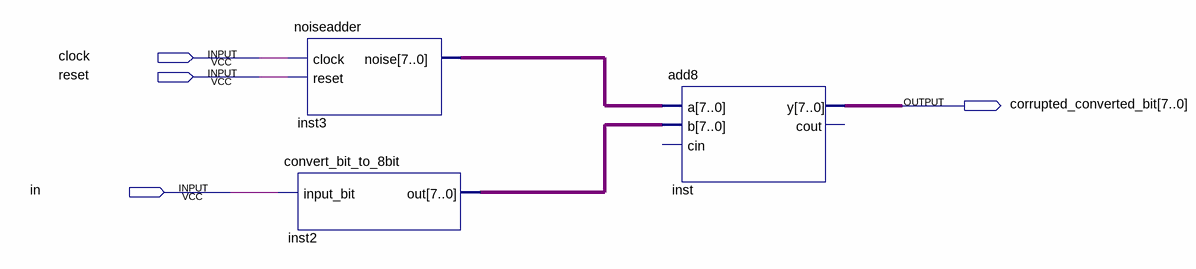
[diagram p0: schematic sheet]
// Quartus schematic convert_corrupt_bit.bdf as structural Verilog: 3 symbols, 4 pins
module convert_corrupt_bit (
  input  clock,
  input  reset,
  input  in,
  output [7:0] corrupted_converted_bit
);

  wire [7:0] inst2_out, inst3_noise;

  noiseadder inst3 (.clock(clock), .reset(reset), .noise(inst3_noise));
  convert_bit_to_8bit inst2 (.input_bit(in), .out(inst2_out));
  add8 inst (.a(inst3_noise), .b(inst2_out), .y(corrupted_converted_bit));  // open: cin, cout
endmodule
